# Altium schematic sheet WL_430.SchDoc
size A3; SheetNumber: 9; SheetTotal: 9
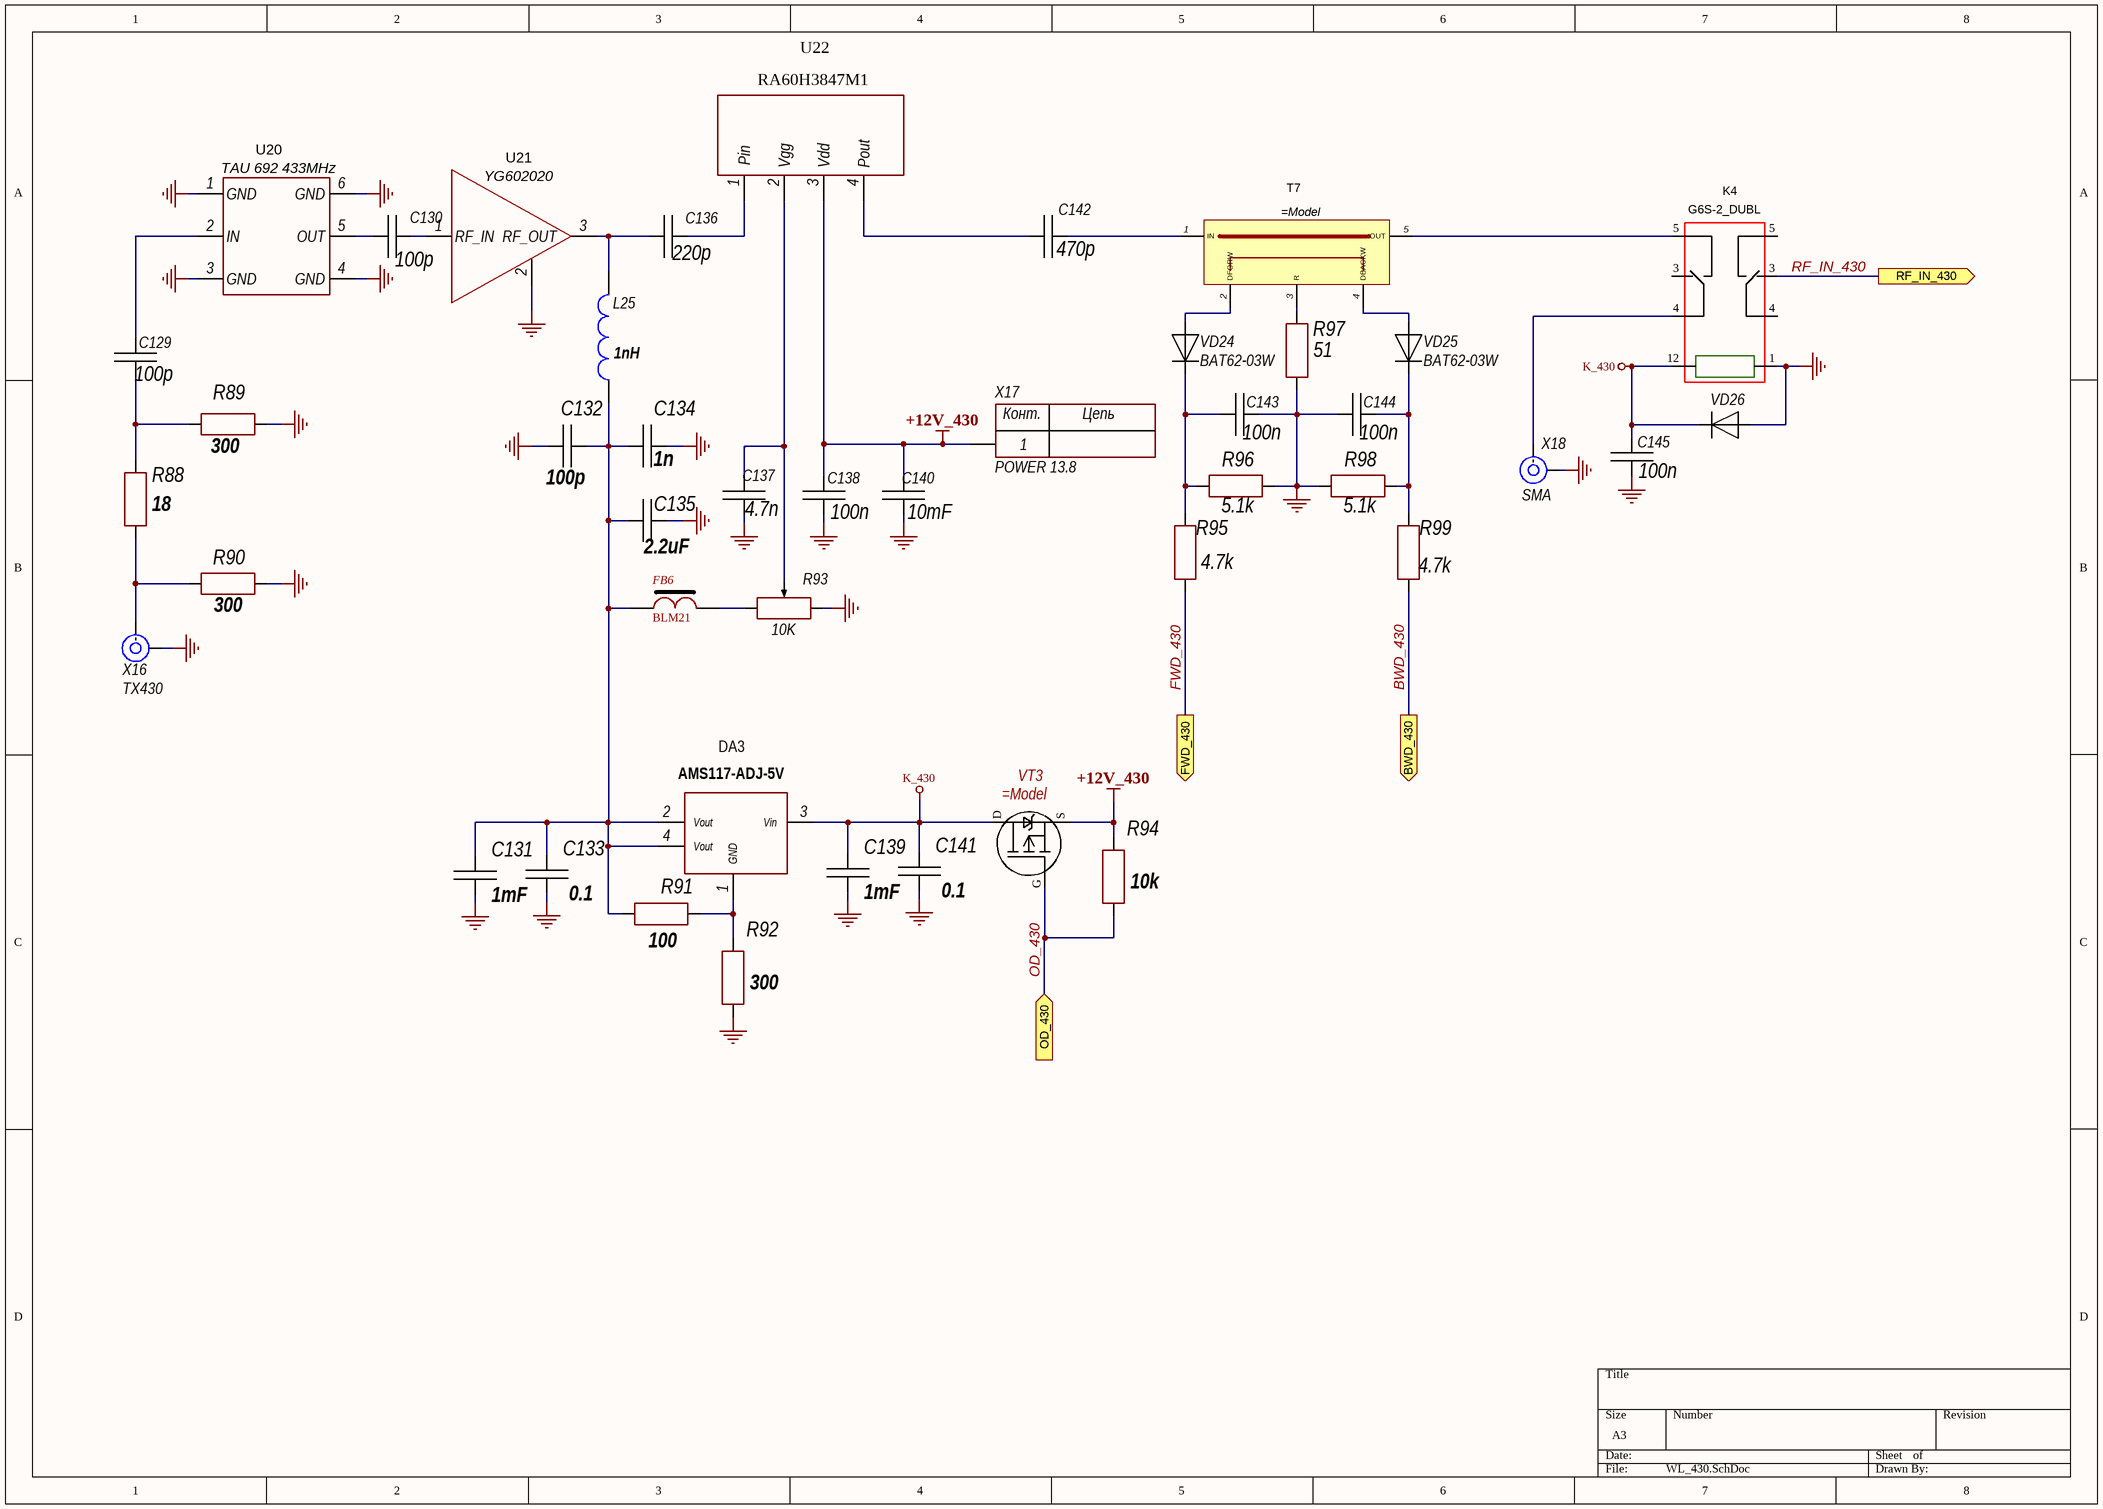
[diagram p0: WL_430.SchDoc]

## Parts
C129  100p  [CH0805C]
C130  100p  [CH0805C]
C131  1mF  [CH0805C]
C132  100p  [CH0805C]
C133  0.1  [CH0805C]
C134  1n  [CH0805C]
C135  2.2uF  [CH0805C]
C136  220p  [CH0805C]
C137  4.7n  [CH0805C]
C138  100n  [CH1206C]
C139  1mF  [CH0805C]
C140  10mF  [CH1206C]
C141  0.1  [CH0805C]
C142  470p  [CH1210C]
C143  100n  [CH0805C]
C144  100n  [CH0805C]
C145  100n  [CH0805C]
DA3  AMS117-ADJ-5V  [SOT223]
FB6  BLM21  [CH0805L]
K4  G6S-2_DUBL  [G6S-2_DUBL]
L25  1nH  [katuhka]
R88  18  [CH0805R]
R89  300  [CH0805R]
R90  300  [CH0805R]
R91  100  [CH0805R]
R92  300  [CH0805R]
R93  10K  [RES: 3296W]
R94  10k  [CH0805R]
R95  4.7k  [CH0805R]
R96  5.1k  [CH0805R]
R97  51  [CH1206R]
R98  5.1k  [CH0805R]
R99  4.7k  [CH0805R]
T7  (no value)  [SWR_D]
U20  TAU 692 433MHz  [TAU692]
U21  YG602020  [SOT89_123]
U22  RA60H3847M1  [RA80H1415M1 - duplicate]
VD24  BAT62-03W  [1N4148]
VD25  BAT62-03W  [1N4148]
VD26  (no value)  [1N4148]
VT3  (no value)  [SOT23_132]
X16  TX430  [CON: u.Fl]
X17  POWER 13.8  [CON: KNIFE_5MM]
X18  SMA  [CON: SMA]

## Ports
BWD_430 (out), FWD_430 (out), OD_430 (in), RF_IN_430 (out)

## Nets
+12V_430: C138.2 C140.2 R94.2 U22.3(Vdd) VT3.2(Исток) X17.1
GND: C131.1 C132.2 C133.1 C134.2 C135.2 C137.1 C138.1 C139.1 C140.1 C141.1 C143.1 C144.2 C145.2 K4.1 R89.1 R90.1 R92.1 R93.1 R96.1 R97.1 R98.2 U20.1(GND) U20.3(GND) U20.4(GND) U20.6(GND) U21.2(GND) VD26.1 X16.2(IN) X18.2(IN)
K_430: C139.2 C141.2 C145.1 DA3.3(Vin) K4.12 VD26.2 VT3.3(Сток)
BWD_430: R99.2 ; port BWD_430
FWD_430: R95.2 ; port FWD_430
OD_430: R94.1 VT3.1(Затвор(Gate)) ; port OD_430
RF_IN_430: K4.3 ; port RF_IN_430
NetC129_1: C129.1 U20.2(IN)
NetC129_2: C129.2 R88.1 R89.2
NetC130_1: C130.1 U21.1(RF_IN)
NetC130_2: C130.2 U20.5(OUT)
NetC131_2: C131.2 C132.1 C133.2 C134.1 C135.1 DA3.2(Vout) DA3.4(Vout) FB6.1 L25.2 R91.2
NetC136_1: C136.1 U22.1(Pin)
NetC136_2: C136.2 L25.1 U21.3(RF_OUT)
NetC137_2: C137.2 R93.2 U22.2(Vgg)
NetC142_1: C142.1 T7.1(IN)
NetC142_2: C142.2 U22.4(Pout)
NetC143_2: C143.2 R95.1 R96.2 VD24.2
NetC144_1: C144.1 R98.1 R99.1 VD25.2
NetDA3_1: DA3.1(GND) R91.1 R92.2
NetFB6_2: FB6.2 R93.3
NetK4_4: K4.4 X18.1(IN)
NetK4_5: K4.5 T7.5(OUT)
NetR88_2: R88.2 R90.2 X16.1(IN)
NetR97_2: R97.2 T7.3(R)
NetT7_2: T7.2(DFORW) VD24.1
NetT7_4: T7.4(DBACKW) VD25.1

## Notes on the sheet
- (in symbol 1-Connector) Конт.; Цепь
- (in symbol P-KANAL) D; S; G

## Library data of the parts
C129-C145 = Capacitor: Manufacturer: *; Model: *; HelpURL: *; ComponentKind: *; Value: *
DA3 = AMS117
FB6 = FB-1
L25 = Inductor ring: Value: {Value}; Model: *; ComponentKind: *; Manufacturer: *; HelpURL: *
R88-R92 R94-R99 = Resistor: Manufacturer: *; Model: *; HelpURL: *; ComponentKind: *; Value: *
R93 = ADJ resistor: Manufacturer: *; Model: *; HelpURL: *; ComponentKind: *; Value: *
T7 = VHF_KSV1
U20 = TAU692
U22 = RA80H1415M1
VD24-VD26 = Diod: ComponentKind: *; Manufacturer: *; Model: *; HelpURL: *
VT3 = P-KANAL
X16 X18 = SMA: RF; Model: *; Manufacturer: *; HelpURL: *; ComponentKind: *
X17 = 1-Connector: Model: *; Manufacturer: *; HelpURL: *; ComponentKind: *